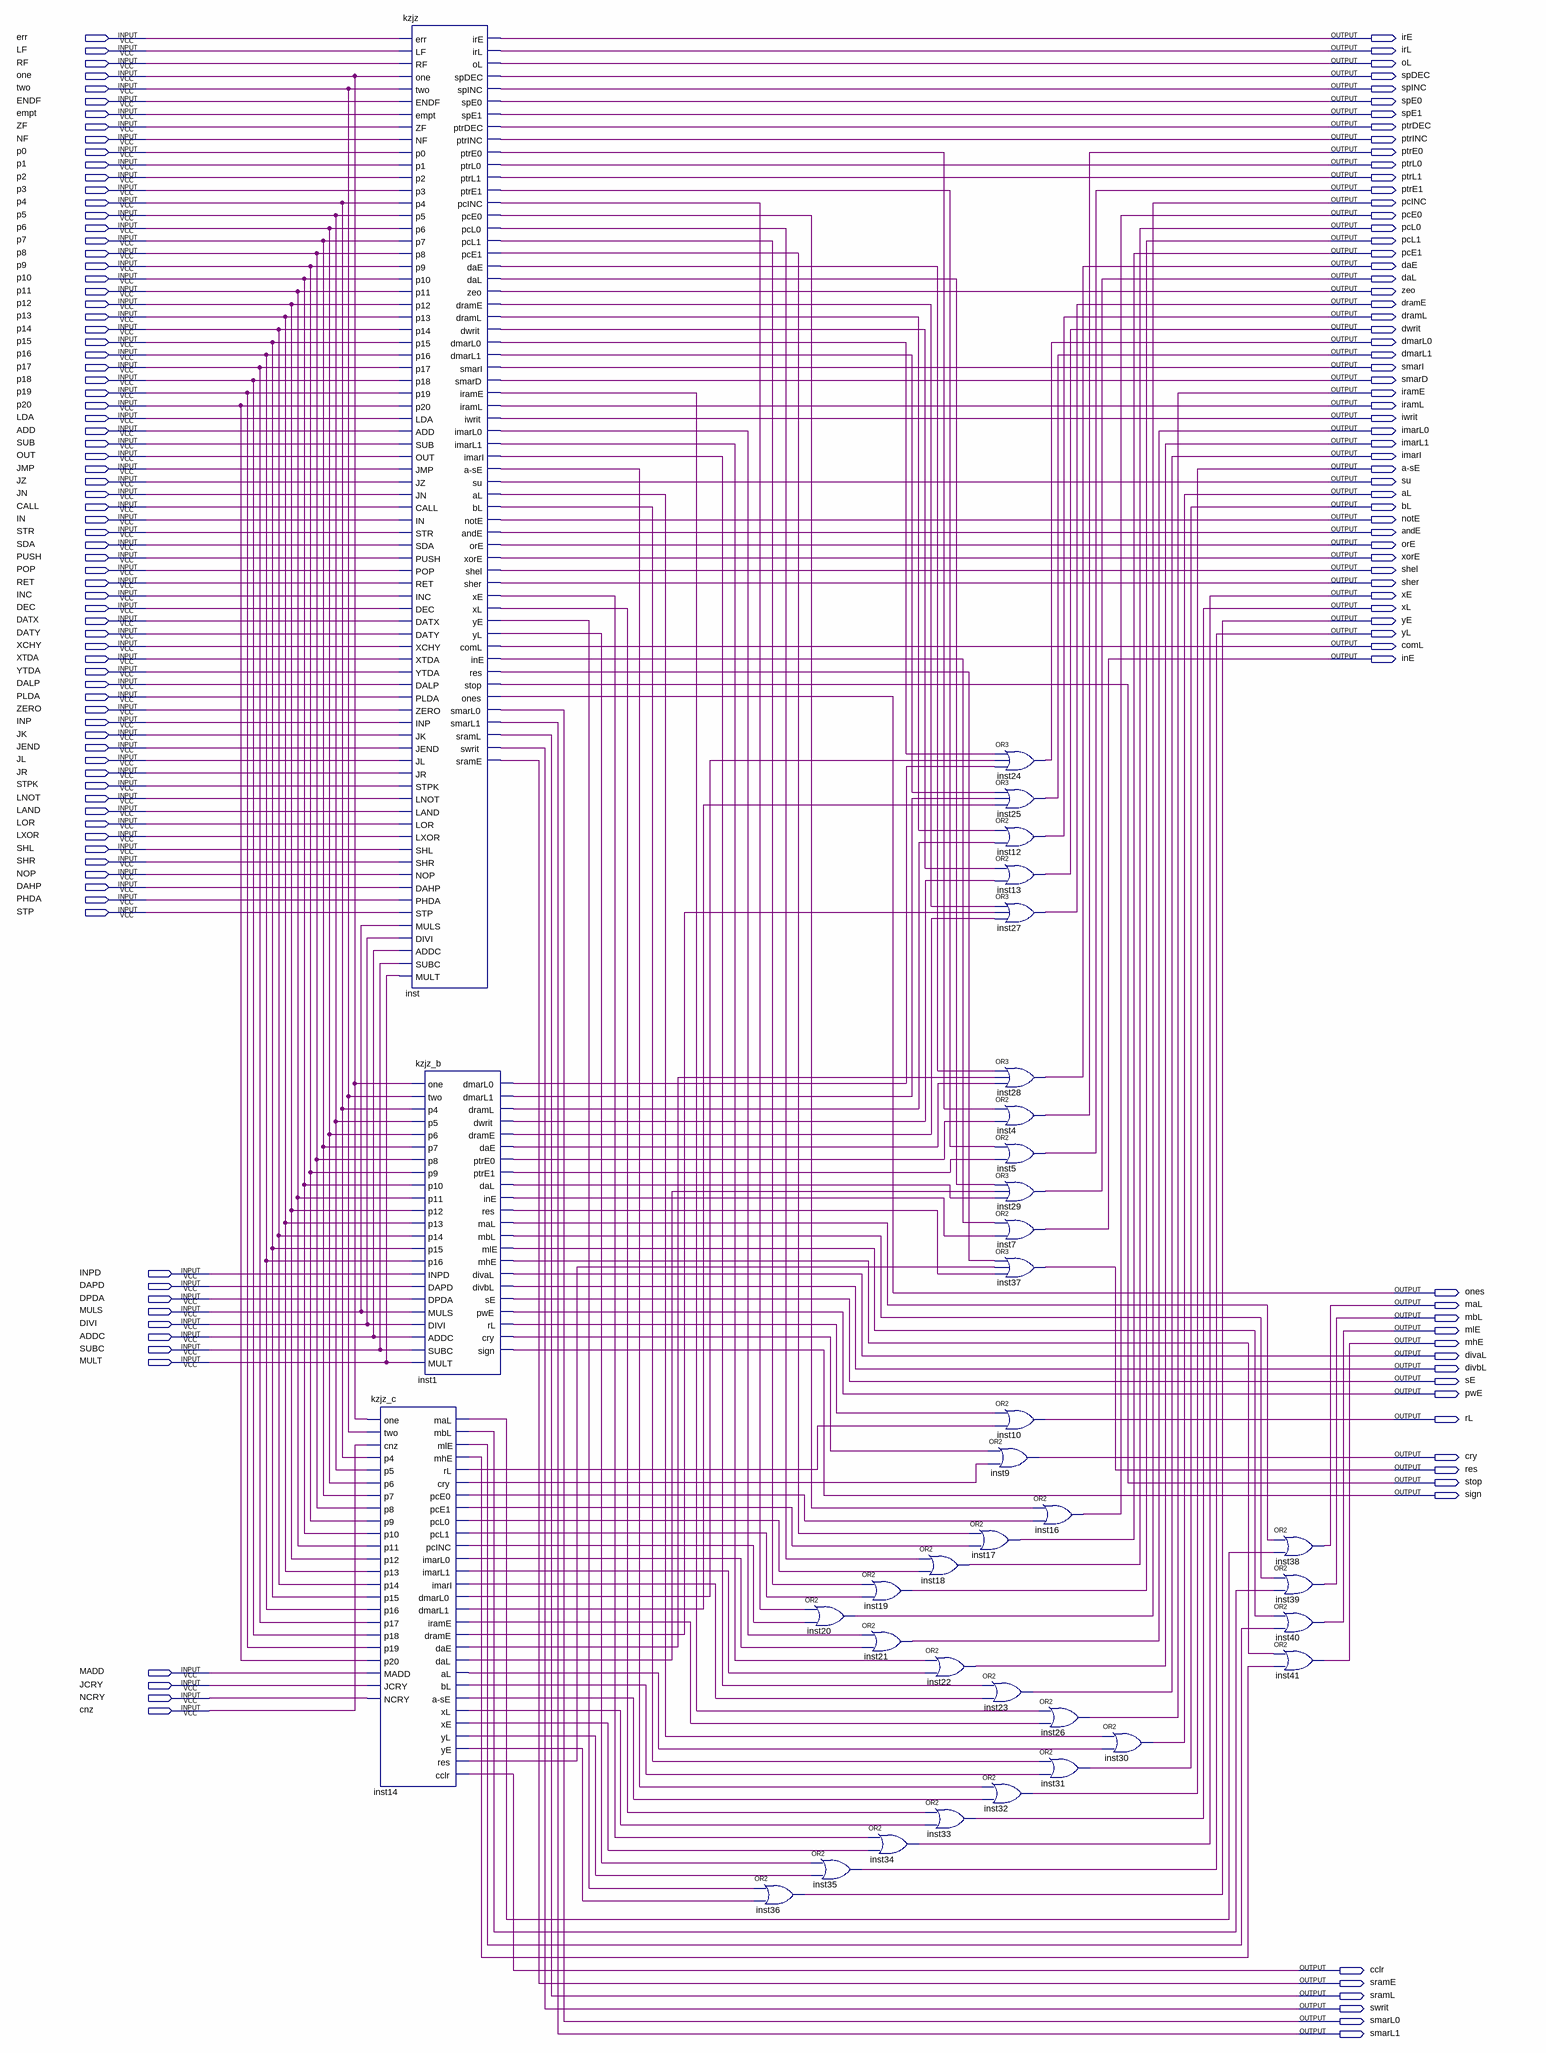
[diagram p0: schematic sheet]
// Quartus schematic kzjzs.bdf as structural Verilog: 36 symbols, 152 pins
module kzjzs (
  input  err,
  input  LF,
  input  RF,
  input  one,
  input  two,
  input  ENDF,
  input  empt,
  input  ZF,
  input  NF,
  input  p0,
  input  p1,
  input  p2,
  input  p3,
  input  p4,
  input  p5,
  input  p6,
  input  p7,
  input  p8,
  input  p9,
  input  p10,
  input  p11,
  input  p12,
  input  p13,
  input  p14,
  input  p15,
  input  p16,
  input  p17,
  input  p18,
  input  p19,
  input  p20,
  input  LDA,
  input  ADD,
  input  SUB,
  input  OUT,
  input  JMP,
  input  JZ,
  input  JN,
  input  CALL,
  input  IN,
  input  STR,
  input  SDA,
  input  PUSH,
  input  POP,
  input  RET,
  input  INC,
  input  DEC,
  input  DATX,
  input  DATY,
  input  XCHY,
  input  XTDA,
  input  YTDA,
  input  DALP,
  input  PLDA,
  input  ZERO,
  input  INP,
  input  JK,
  input  JEND,
  input  JL,
  input  JR,
  input  STPK,
  input  LNOT,
  input  LAND,
  input  LOR,
  input  LXOR,
  input  SHL,
  input  SHR,
  input  NOP,
  input  DAHP,
  input  PHDA,
  input  STP,
  input  INPD,
  input  DAPD,
  input  DPDA,
  input  MULS,
  input  DIVI,
  input  ADDC,
  input  SUBC,
  input  MULT,
  input  MADD,
  input  JCRY,
  input  NCRY,
  input  cnz,
  output irE,
  output irL,
  output oL,
  output spDEC,
  output spINC,
  output spE0,
  output spE1,
  output ptrDEC,
  output ptrINC,
  output ptrE0,
  output ptrL0,
  output ptrL1,
  output ptrE1,
  output pcINC,
  output pcE0,
  output pcL0,
  output pcL1,
  output pcE1,
  output daE,
  output daL,
  output zeo,
  output dramE,
  output dramL,
  output dwrit,
  output dmarL0,
  output dmarL1,
  output smarI,
  output smarD,
  output iramE,
  output iramL,
  output iwrit,
  output imarL0,
  output imarL1,
  output imarI,
  output \a-sE ,
  output su,
  output aL,
  output bL,
  output notE,
  output andE,
  output orE,
  output xorE,
  output shel,
  output sher,
  output xE,
  output xL,
  output yE,
  output yL,
  output comL,
  output inE,
  output ones,
  output maL,
  output mbL,
  output mlE,
  output mhE,
  output divaL,
  output divbL,
  output sE,
  output pwE,
  output rL,
  output cry,
  output res,
  output stop,
  output sign,
  output cclr,
  output sramE,
  output sramL,
  output swrit,
  output smarL0,
  output smarL1
);

  wire inst1_cry, inst1_dae, inst1_dal, inst1_dmarl0, inst1_dmarl1, inst1_drame, inst1_draml, inst1_dwrit,
       inst1_ine, inst1_mal, inst1_mbl, inst1_mhe, inst1_mle, inst1_ptre0, inst1_ptre1, inst1_res, inst1_rl,
       inst14_a_se, inst14_al, inst14_bl, inst14_cry, inst14_dae, inst14_dal, inst14_dmarl0, inst14_dmarl1,
       inst14_drame, inst14_imari, inst14_imarl0, inst14_imarl1, inst14_irame, inst14_mal, inst14_mbl,
       inst14_mhe, inst14_mle, inst14_pce0, inst14_pce1, inst14_pcinc, inst14_pcl0, inst14_pcl1, inst14_res,
       inst14_rl, inst14_xe, inst14_xl, inst14_ye, inst14_yl, inst_a_se, inst_al, inst_bl, inst_dae,
       inst_dal, inst_dmarl0, inst_dmarl1, inst_drame, inst_draml, inst_dwrit, inst_imari, inst_imarl0,
       inst_imarl1, inst_ine, inst_irame, inst_pce0, inst_pce1, inst_pcinc, inst_pcl0, inst_pcl1, inst_ptre0,
       inst_ptre1, inst_res, inst_xe, inst_xl, inst_ye, inst_yl;

  kzjz_c inst14 (
    .one(one), .two(two), .cnz(cnz), .p4(p4), .p5(p5), .p6(p6), .p7(p7), .p8(p8), .p9(p9), .p10(p10),
    .p11(p11), .p12(p12), .p13(p13), .p14(p14), .p15(p15), .p16(p16), .p17(p17), .p18(p18), .p19(p19),
    .p20(p20), .MADD(MADD), .JCRY(JCRY), .NCRY(NCRY), .maL(inst14_mal), .mbL(inst14_mbl), .mlE(inst14_mle),
    .mhE(inst14_mhe), .rL(inst14_rl), .cry(inst14_cry), .pcE0(inst14_pce0), .pcE1(inst14_pce1),
    .pcL0(inst14_pcl0), .pcL1(inst14_pcl1), .pcINC(inst14_pcinc), .imarL0(inst14_imarl0),
    .imarL1(inst14_imarl1), .imarI(inst14_imari), .dmarL0(inst14_dmarl0), .dmarL1(inst14_dmarl1),
    .iramE(inst14_irame), .dramE(inst14_drame), .daE(inst14_dae), .daL(inst14_dal), .aL(inst14_al),
    .bL(inst14_bl), .\a-sE (inst14_a_se), .xL(inst14_xl), .xE(inst14_xe), .yL(inst14_yl), .yE(inst14_ye),
    .res(inst14_res), .cclr(cclr));
  kzjz inst (
    .err(err), .LF(LF), .RF(RF), .one(one), .two(two), .ENDF(ENDF), .empt(empt), .ZF(ZF), .NF(NF), .p0(p0),
    .p1(p1), .p2(p2), .p3(p3), .p4(p4), .p5(p5), .p6(p6), .p7(p7), .p8(p8), .p9(p9), .p10(p10), .p11(p11),
    .p12(p12), .p13(p13), .p14(p14), .p15(p15), .p16(p16), .p17(p17), .p18(p18), .p19(p19), .p20(p20),
    .LDA(LDA), .ADD(ADD), .SUB(SUB), .OUT(OUT), .JMP(JMP), .JZ(JZ), .JN(JN), .CALL(CALL), .IN(IN), .STR(STR),
    .SDA(SDA), .PUSH(PUSH), .POP(POP), .RET(RET), .INC(INC), .DEC(DEC), .DATX(DATX), .DATY(DATY),
    .XCHY(XCHY), .XTDA(XTDA), .YTDA(YTDA), .DALP(DALP), .PLDA(PLDA), .ZERO(ZERO), .INP(INP), .JK(JK),
    .JEND(JEND), .JL(JL), .JR(JR), .STPK(STPK), .LNOT(LNOT), .LAND(LAND), .LOR(LOR), .LXOR(LXOR), .SHL(SHL),
    .SHR(SHR), .NOP(NOP), .DAHP(DAHP), .PHDA(PHDA), .STP(STP), .MULS(MULS), .DIVI(DIVI), .ADDC(ADDC),
    .SUBC(SUBC), .MULT(MULT), .irE(irE), .irL(irL), .oL(oL), .spDEC(spDEC), .spINC(spINC), .spE0(spE0),
    .spE1(spE1), .ptrDEC(ptrDEC), .ptrINC(ptrINC), .ptrE0(inst_ptre0), .ptrL0(ptrL0), .ptrL1(ptrL1),
    .ptrE1(inst_ptre1), .pcINC(inst_pcinc), .pcE0(inst_pce0), .pcL0(inst_pcl0), .pcL1(inst_pcl1),
    .pcE1(inst_pce1), .daE(inst_dae), .daL(inst_dal), .zeo(zeo), .dramE(inst_drame), .dramL(inst_draml),
    .dwrit(inst_dwrit), .dmarL0(inst_dmarl0), .dmarL1(inst_dmarl1), .smarI(smarI), .smarD(smarD),
    .iramE(inst_irame), .iramL(iramL), .iwrit(iwrit), .imarL0(inst_imarl0), .imarL1(inst_imarl1),
    .imarI(inst_imari), .\a-sE (inst_a_se), .su(su), .aL(inst_al), .bL(inst_bl), .notE(notE), .andE(andE),
    .orE(orE), .xorE(xorE), .shel(shel), .sher(sher), .xE(inst_xe), .xL(inst_xl), .yE(inst_ye), .yL(inst_yl),
    .comL(comL), .inE(inst_ine), .res(inst_res), .stop(stop), .ones(ones), .smarL0(smarL0), .smarL1(smarL1),
    .sramL(sramL), .swrit(swrit), .sramE(sramE));
  kzjz_b inst1 (
    .one(one), .two(two), .p4(p4), .p5(p5), .p6(p6), .p7(p7), .p8(p8), .p9(p9), .p10(p10), .p11(p11),
    .p12(p12), .p13(p13), .p14(p14), .p15(p15), .p16(p16), .INPD(INPD), .DAPD(DAPD), .DPDA(DPDA),
    .MULS(MULS), .DIVI(DIVI), .ADDC(ADDC), .SUBC(SUBC), .MULT(MULT), .dmarL0(inst1_dmarl0),
    .dmarL1(inst1_dmarl1), .dramL(inst1_draml), .dwrit(inst1_dwrit), .dramE(inst1_drame), .daE(inst1_dae),
    .ptrE0(inst1_ptre0), .ptrE1(inst1_ptre1), .daL(inst1_dal), .inE(inst1_ine), .res(inst1_res),
    .maL(inst1_mal), .mbL(inst1_mbl), .mlE(inst1_mle), .mhE(inst1_mhe), .divaL(divaL), .divbL(divbL),
    .sE(sE), .pwE(pwE), .rL(inst1_rl), .cry(inst1_cry), .sign(sign));
  or inst36 (yE, inst_ye, inst14_ye);
  or inst20 (pcINC, inst_pcinc, inst14_pcinc);
  or inst35 (yL, inst_yl, inst14_yl);
  or inst19 (pcL1, inst_pcl1, inst14_pcl1);
  or inst21 (imarL0, inst_imarl0, inst14_imarl0);
  or inst34 (xE, inst_xe, inst14_xe);
  or inst18 (pcL0, inst_pcl0, inst14_pcl0);
  or inst22 (imarL1, inst_imarl1, inst14_imarl1);
  or inst33 (xL, inst_xl, inst14_xl);
  or inst9 (cry, inst1_cry, inst14_cry);
  or inst17 (pcE1, inst_pce1, inst14_pce1);
  or inst23 (imarI, inst_imari, inst14_imari);
  or inst32 (\a-sE , inst_a_se, inst14_a_se);
  or inst24 (dmarL0, inst_dmarl0, inst14_dmarl0, inst1_dmarl0);
  or inst25 (dmarL1, inst_dmarl1, inst1_dmarl1, inst14_dmarl1);
  or inst12 (dramL, inst_draml, inst1_draml);
  or inst13 (dwrit, inst_dwrit, inst1_dwrit);
  or inst27 (dramE, inst_drame, inst14_drame, inst1_drame);
  or inst28 (daE, inst_dae, inst14_dae, inst1_dae);
  or inst4 (ptrE0, inst_ptre0, inst1_ptre0);
  or inst5 (ptrE1, inst_ptre1, inst1_ptre1);
  or inst29 (daL, inst_dal, inst14_dal, inst1_dal);
  or inst7 (inE, inst_ine, inst1_ine);
  or inst37 (res, inst_res, inst14_res, inst1_res);
  or inst10 (rL, inst1_rl, inst14_rl);
  or inst16 (pcE0, inst_pce0, inst14_pce0);
  or inst26 (iramE, inst_irame, inst14_irame);
  or inst31 (bL, inst_bl, inst14_bl);
  or inst30 (aL, inst_al, inst14_al);
  or inst38 (maL, inst1_mal, inst14_mal);
  or inst39 (mbL, inst1_mbl, inst14_mbl);
  or inst40 (mlE, inst1_mle, inst14_mle);
  or inst41 (mhE, inst1_mhe, inst14_mhe);
endmodule
